# EAGLE schematic TheLittleEngineers.org-27C512E-TO-2532S-V1R1.20.APRIL.2019 (EAGLE 9.4.0)
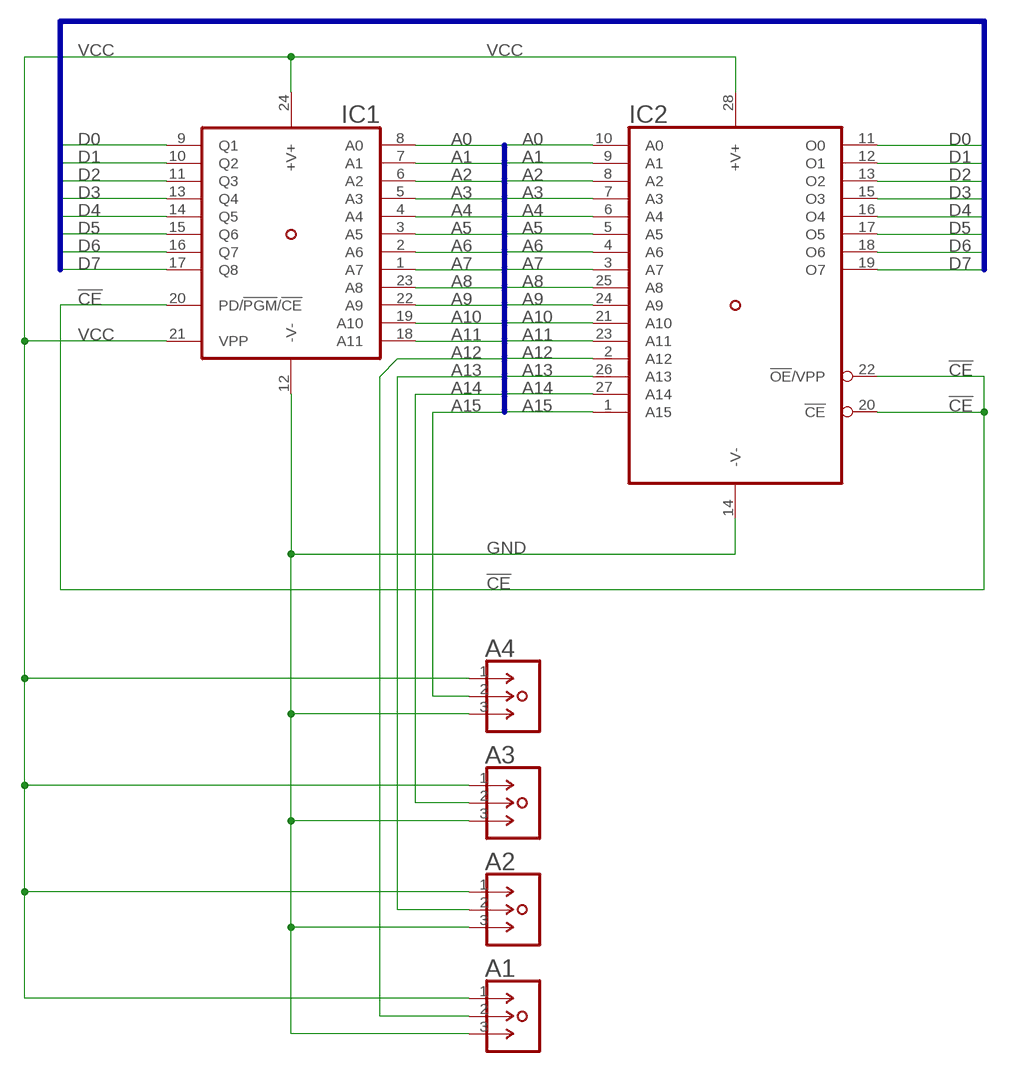
[diagram p0: schematic, sheet 1]

## Parts
A1  1X03-STAGGERED-S  [1X03-STAGGERED]
A2  1X03-STAGGERED-S  [1X03-STAGGERED]
A3  1X03-STAGGERED-S  [1X03-STAGGERED]
A4  1X03-STAGGERED-S  [1X03-STAGGERED]
IC1  TMS2532-NO  [DIL24-6-NO-OUTLINE]
IC2  27C512D-NO  [DIL28-6-NO-OUTLINE]

## Nets
!CE: IC1.20(PD/!PGM!/!CE) IC2.20(!CE) IC2.22(!OE!/VPP)
A0: IC1.8(A0) IC2.10(A0)
A1: IC1.7(A1) IC2.9(A1)
A2: IC1.6(A2) IC2.8(A2)
A3: IC1.5(A3) IC2.7(A3)
A4: IC1.4(A4) IC2.6(A4)
A5: IC1.3(A5) IC2.5(A5)
A6: IC1.2(A6) IC2.4(A6)
A7: IC1.1(A7) IC2.3(A7)
A8: IC1.23(A8) IC2.25(A8)
A9: IC1.22(A9) IC2.24(A9)
A10: IC1.19(A10) IC2.21(A10)
A11: IC1.18(A11) IC2.23(A11)
A12: A1.2 IC2.2(A12)
A13: A2.2 IC2.26(A13)
A14: A3.2 IC2.27(A14)
A15: A4.2 IC2.1(A15)
D0: IC1.9(Q1) IC2.11(O0)
D1: IC1.10(Q2) IC2.12(O1)
D2: IC1.11(Q3) IC2.13(O2)
D3: IC1.13(Q4) IC2.15(O3)
D4: IC1.14(Q5) IC2.16(O4)
D5: IC1.15(Q6) IC2.17(O5)
D6: IC1.16(Q7) IC2.18(O6)
D7: IC1.17(Q8) IC2.19(O7)
GND [power]: A1.3 A2.3 A3.3 A4.3 IC1.12(-V-) IC2.14(-V-)
VCC [power]: A1.1 A2.1 A3.1 A4.1 IC1.21(VPP) IC1.24(+V+) IC2.28(+V+)

## Buses
D[0..7]
A[0..15]

## Library data of the parts
A1-A4 = TheLittleEngineers.org-27C512E-TO-2532S-V1R0.20.APRIL.2019:1X03-STAGGERED: 3-Pin SIP Header Copyright ©07 Jan 2013, by: Robert "The R.A.T." Allen Turner http://www.TheLittleEngineers.org/ TheLittleEngineers@outlook.com OurLittleEngineers@gMail.com You may use these components in your own projects, however, please take note that we CANNOT guarantee the accuracy of these components (nor any part of this library). We make NO guarantees that the components, footprints or schematic symbols in this library are flawless, and we make no promises of fitness for production, prototyping or any other purpose. These libraries are provided for informational purposes only, and are used at your own discretion. By downloading these libraries, you agree that we cannot be held responsible for faulty PCBs. You should always check the footprints with a 1:1 printout. Neither Robert Allen Turner, The Little Engineers <http://www.TheLittleEngineers.org/>, TheLittleEngineers.org, GIMEchip.com, nor anyone affiliated with same shall be held responsible for any outcome resulting from the usage of these files. Should any errors be found, please contact us at one of the above email addresses and we will attempt to repair them. Unless otherwise noted, content of this library is licensed under a Creative Commons Attribution-ShareAlike 4.0 International (CC BY-SA 4.0) license (https://creativecommons.org/licenses/by-sa/4.0/) on 20 April 2019 in memory of my Father, Robert Embry Turner - I LOVE YOU DAD! Rest In Peace. Please note that the GIMEchip.com domain was acquired by Robert "The R.A.T." Allen Turner on December 24, 2018 from the prior owners, which happen to be his brother and nephew. As such, "The R.A.T." is unable to answer any inquiries regarding any products or services of GIMEchip.com prior to that date. "The R.A.T." also acquired the rights to all products previously produced by GIMEchip.com and its previous owners. Those products will all be released as open source, under a Creative Commons Attribution-ShareAlike 4.0 International (CC BY-SA 4.0) license (https://creativecommons.org/licenses/by-sa/4.0/), as time and resources permit.
IC1 = TheLittleEngineers.org-27C512E-TO-2532S-V1R0.20.APRIL.2019:TMS2532: TMS2532 Copyright ©07 Jan 2013, by: Robert "The R.A.T." Allen Turner http://www.TheLittleEngineers.org/ TheLittleEngineers@outlook.com OurLittleEngineers@gMail.com You may use these components in your own projects, however, please take note that we CANNOT guarantee the accuracy of these components (nor any part of this library). We make NO guarantees that the components, footprints or schematic symbols in this library are flawless, and we make no promises of fitness for production, prototyping or any other purpose. These libraries are provided for informational purposes only, and are used at your own discretion. By downloading these libraries, you agree that we cannot be held responsible for faulty PCBs. You should always check the footprints with a 1:1 printout. Neither Robert Allen Turner, The Little Engineers <http://www.TheLittleEngineers.org/>, TheLittleEngineers.org, GIMEchip.com, nor anyone affiliated with same shall be held responsible for any outcome resulting from the usage of these files. Should any errors be found, please contact us at one of the above email addresses and we will attempt to repair them. Unless otherwise noted, content of this library is licensed under a Creative Commons Attribution-ShareAlike 4.0 International (CC BY-SA 4.0) license (https://creativecommons.org/licenses/by-sa/4.0/) on 20 April 2019 in memory of my Father, Robert Embry Turner - I LOVE YOU DAD! Rest In Peace. Please note that the GIMEchip.com domain was acquired by Robert "The R.A.T." Allen Turner on December 24, 2018 from the prior owners, which happen to be his brother and nephew. As such, "The R.A.T." is unable to answer any inquiries regarding any products or services of GIMEchip.com prior to that date. "The R.A.T." also acquired the rights to all products previously produced by GIMEchip.com and its previous owners. Those products will all be released as open source, under a Creative Commons Attribution-ShareAlike 4.0 International (CC BY-SA 4.0) license (https://creativecommons.org/licenses/by-sa/4.0/), as time and resources permit.
IC2 = TheLittleEngineers.org-27C512E-TO-2532S-V1R0.20.APRIL.2019:27C512D: 27C512D Copyright ©07 Jan 2013, by: Robert "The R.A.T." Allen Turner http://www.TheLittleEngineers.org/ TheLittleEngineers@outlook.com OurLittleEngineers@gMail.com You may use these components in your own projects, however, please take note that we CANNOT guarantee the accuracy of these components (nor any part of this library). We make NO guarantees that the components, footprints or schematic symbols in this library are flawless, and we make no promises of fitness for production, prototyping or any other purpose. These libraries are provided for informational purposes only, and are used at your own discretion. By downloading these libraries, you agree that we cannot be held responsible for faulty PCBs. You should always check the footprints with a 1:1 printout. Neither Robert Allen Turner, The Little Engineers <http://www.TheLittleEngineers.org/>, TheLittleEngineers.org, GIMEchip.com, nor anyone affiliated with same shall be held responsible for any outcome resulting from the usage of these files. Should any errors be found, please contact us at one of the above email addresses and we will attempt to repair them. Unless otherwise noted, content of this library is licensed under a Creative Commons Attribution-ShareAlike 4.0 International (CC BY-SA 4.0) license (https://creativecommons.org/licenses/by-sa/4.0/) on 20 April 2019 in memory of my Father, Robert Embry Turner - I LOVE YOU DAD! Rest In Peace. Please note that the GIMEchip.com domain was acquired by Robert "The R.A.T." Allen Turner on December 24, 2018 from the prior owners, which happen to be his brother and nephew. As such, "The R.A.T." is unable to answer any inquiries regarding any products or services of GIMEchip.com prior to that date. "The R.A.T." also acquired the rights to all products previously produced by GIMEchip.com and its previous owners. Those products will all be released as open source, under a Creative Commons Attribution-ShareAlike 4.0 International (CC BY-SA 4.0) license (https://creativecommons.org/licenses/by-sa/4.0/), as time and resources permit.

## Net classes
0 default: width 0.203 mm, clearance 0.203 mm
1 power: width 0.381 mm, clearance 0.203 mm